# EAGLE design sensor dev board (EAGLE 6.4)
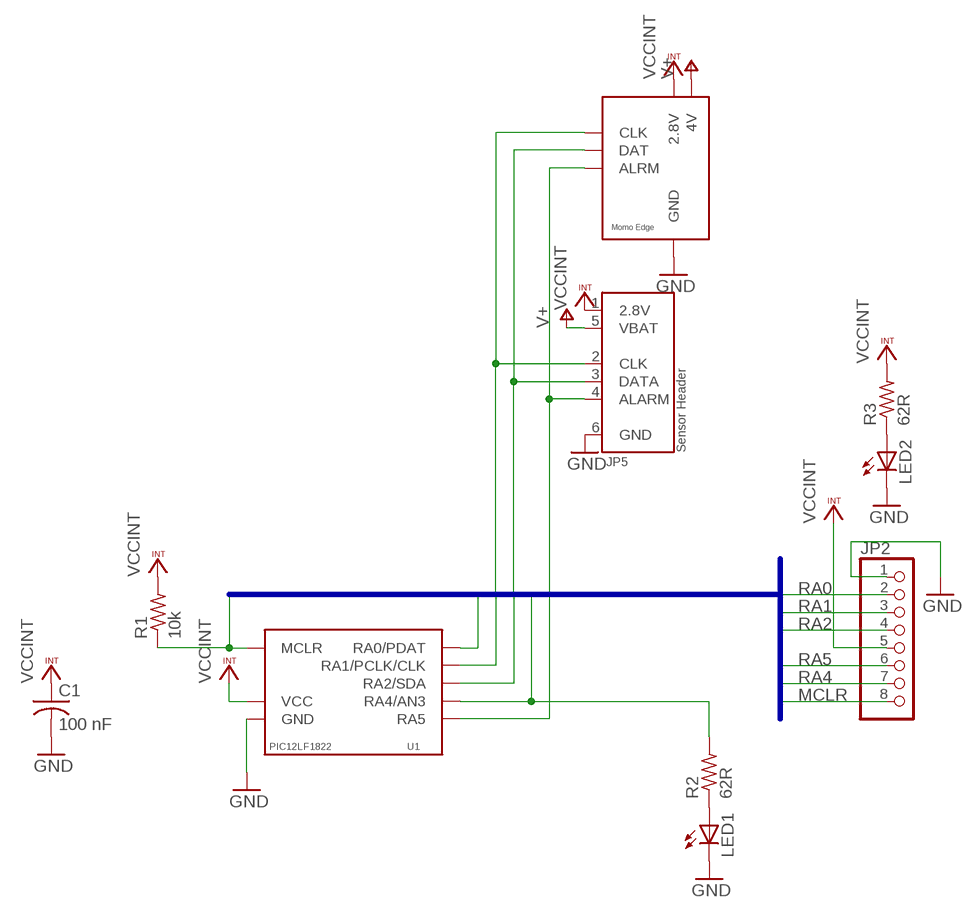
[diagram p0: schematic, sheet 1]

## Parts
C1  100 nF  C-USC0402  [C0402]
JP2  PINHD-1X8  [1X08]
JP4  MOMO-VERT-6M  [1X06]
JP5  MOMO-SENSOR-RJ11  [RJ-12]
LED1  LEDCHIP-LED0603  [CHIP-LED0603]
LED2  LEDCHIP-LED0603  [CHIP-LED0603]
R1  10k  R-US_R0603  [R0603]
R2  62R  R-US_R0603  [R0603]
R3  62R  R-US_R0603  [R0603]
U1  PIC12LF1822  [SOIC8]

## Nets
GND: C1.2 JP2.1 JP4.7(GND) JP5.6(GND) LED1.C LED2.C U1.8(GND)
MCLR: JP2.8 R1.1 U1.4(MCLR)
N$1: LED1.A R2.1
N$2: LED2.A R3.1
RA0: JP2.2 U1.7(RA0/PDAT)
RA1: JP2.3 JP4.3(CLK) JP5.2(CLK) U1.6(RA1/PCLK/CLK)
RA2: JP2.4 JP4.4(DAT) JP5.3(DATA) U1.5(RA2/SDA)
RA4: JP2.7 R2.2 U1.3(RA4/AN3)
RA5: JP2.6 JP4.5(ALRM) JP5.4(ALARM) U1.2(RA5)
V+: JP4.6(4V) JP5.5(VBAT)
VCCINT: C1.1 JP2.5 JP4.1(2.8V) JP5.1(2.8V) R1.2 R3.2 U1.1(VCC)

## Buses
BUS:MCLR,POWER28,RA0,RA1,RA2,RA4,RA5

## Library data of the parts
C1 = rcl:C-US: CAPACITOR, American symbol; DIGIKEY-PN: 445-1265-1-ND
JP2 = pinhead:PINHD-1X8: PIN HEADER; DIGIKEY-PN: S1012EC-08-ND
JP4 = components:MOMO-VERT-6M; DIGIKEY-PN: S7004-ND
JP5 = components:MOMO-SENSOR-RJ11; DIGIKEY-PN: AE10383-ND
LED1 LED2 = led:LED: LED OSRAM: - CHIPLED LG R971, LG N971, LY N971, LG Q971, LY Q971, LO R971, LY R971 LH N974, LH R974 LS Q976, LO Q976, LY Q976 LO Q996 - Hyper CHIPLED LW Q18S LB Q993, LB Q99A, LB R99A - SideLED LS A670, LO A670, LY A670, LG A670, LP A670 LB A673, LV A673, LT A673, LW A673 LH A674 LY A675 LS A676, LA A676, LO A676, LY A676, LW A676 LS A679, LY A679, LG A679 - Hyper Micro SIDELED® LS Y876, LA Y876, LO Y876, LY Y876 LT Y87S - SmartLED LW L88C, LW L88S LB L89C, LB L89S, LG L890 LS L89K, LO L89K, LY L89K LS L896, LA L896, LO L896, LY L896 - TOPLED LS T670, LO T670, LY T670, LG T670, LP T670 LSG T670, LSP T670, LSY T670, LOP T670, LYG T670 LG T671, LOG T671, LSG T671 LB T673, LV T673, LT T673, LW T673 LH T674 LS T676, LA T676, LO T676, LY T676, LB T676, LH T676, LSB T676, LW T676 LB T67C, LV T67C, LT T67C, LS T67K, LO T67K, LY T67K, LW E67C LS E67B, LA E67B, LO E67B, LY E67B, LB E67C, LV E67C, LT E67C LW T67C LS T679, LY T679, LG T679 LS T770, LO T770, LY T770, LG T770, LP T770 LB T773, LV T773, LT T773, LW T773 LH T774 LS E675, LA E675, LY E675, LS T675 LS T776, LA T776, LO T776, LY T776, LB T776 LHGB T686 LT T68C, LB T68C - Hyper Mini TOPLED® LB M676 - Mini TOPLED Santana® LG M470 LS M47K, LO M47K, LY M47K Source: http://www.osram.convergy.de LUXEON: - LUMILED® LXK2-PW12-R00, LXK2-PW12-S00, LXK2-PW14-U00, LXK2-PW14-V00 LXK2-PM12-R00, LXK2-PM12-S00, LXK2-PM14-U00 LXK2-PE12-Q00, LXK2-PE12-R00, LXK2-PE12-S00, LXK2-PE14-T00, LXK2-PE14-U00 LXK2-PB12-K00, LXK2-PB12-L00, LXK2-PB12-M00, LXK2-PB14-N00, LXK2-PB14-P00, LXK2-PB14-Q00 LXK2-PR12-L00, LXK2-PR12-M00, LXK2-PR14-Q00, LXK2-PR14-R00 LXK2-PD12-Q00, LXK2-PD12-R00, LXK2-PD12-S00 LXK2-PH12-R00, LXK2-PH12-S00 LXK2-PL12-P00, LXK2-PL12-Q00, LXK2-PL12-R00 Source: www.luxeon.com KINGBRIGHT: KA-3528ASYC Source: www.kingbright.com; DIGIKEY-PN: 475-2709-1-ND
R1 = rcl:R-US_: RESISTOR, American symbol; DIGIKEY-PN: P10.0KHCT-ND
R2 R3 = resistor:R-US_: RESISTOR, American symbol; DIGIKEY-PN: P62GCT-ND
U1 = components:PIC12LF1822; DIGIKEY-PN: PIC12LF1822-I/SN

## Board
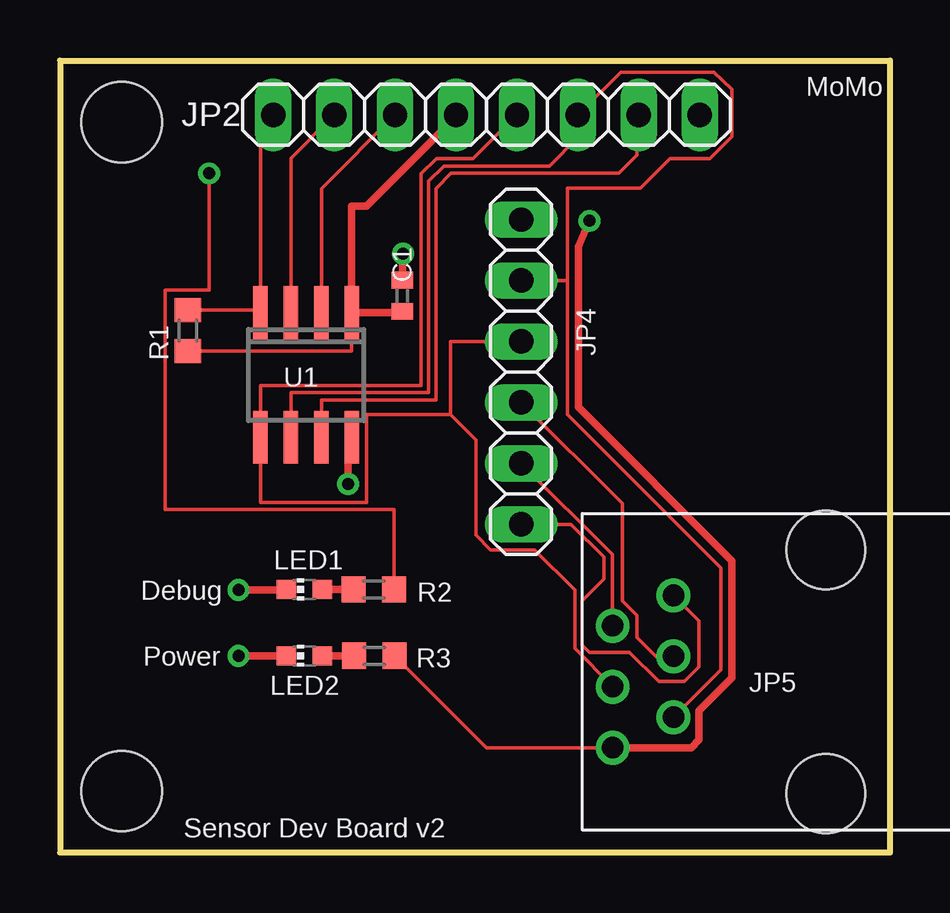
[diagram p1: board, top side]
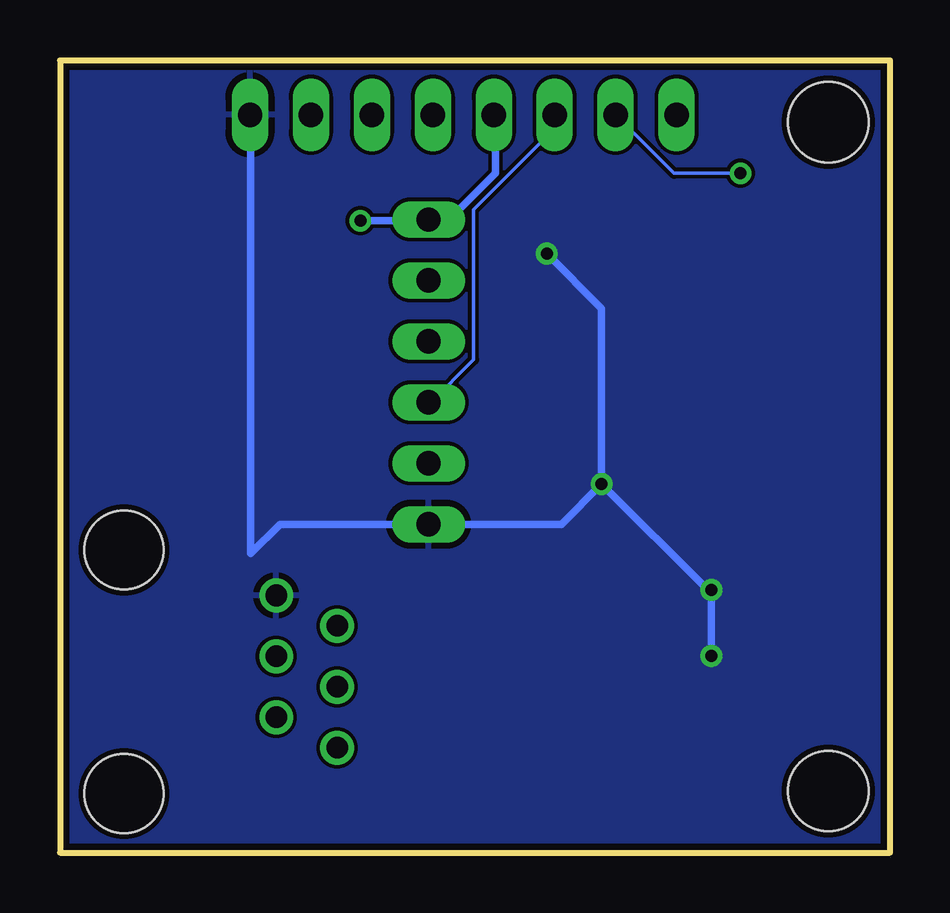
[diagram p2: board, bottom side, seen from below]

Size 34.59 x 33.02 mm. Coordinates in mm from the lower left corner, seen from the top.
Outline: 0,33.02 0,0 34.6,0 34.6,33.02 0,33.02
Copper layers (1*16): Top 0.035mm / dielectric 1.5mm / Bottom 0.035mm
Design rules "default": minimum track width 6mil, minimum drill 19mil, track to track 6mil, track to pad 6mil, pad to pad 6mil, via to via 6mil, smd to smd 6mil, copper to edge 10mil, drill to drill 8mil, minimum pad ring 10mil, minimum via ring 8mil, stop-mask expansion 4mil, vias tented up to drill 0mil, thermal gap 10mil
Holes 3.35 mm at 2.57,30.45 2.57,2.57

### Footprints (pad centres in the part's own frame; a part is rotated, then mirrored left to right if it is on the bottom)
C0402 = smd 0.7 x 0.9: 1 -0.65,0; 2 0.65,0
1X08 = drill 1.016 long: 1 -8.89,0; 2 -6.35,0; 3 -3.81,0; 4 -1.27,0; 5 1.27,0; 6 3.81,0; 7 6.35,0; 8 8.89,0
1X06 = drill 1.016 long: 1 -8.89,0; 3 -6.35,0; 4 -3.81,0; 5 -1.27,0; 6 1.27,0; 7 3.81,0
RJ-12 = drill 0.9: 1 -3.17,8.89; 2 -1.9,6.35; 3 -0.63,8.89; 4 0.64,6.35; 5 1.91,8.89; 6 3.18,6.35 | hole 3.28: -5.08,0; 5.08,0
CHIP-LED0603 = smd 0.8 x 0.8: A 0,-0.75; C 0,0.75
R0603 = smd 1 x 1.1: 1 -0.85,0; 2 0.85,0
SOIC8 = smd 0.6 x 2.2: 1 -1.905,-2.6; 2 -0.635,-2.6; 3 0.635,-2.6; 4 1.905,-2.6; 5 1.905,2.6; 6 0.635,2.6; 7 -0.635,2.6; 8 -1.905,2.6

### Placement (x,y rotation side)
C1  14.27,23.22 90 top
JP2  17.78,30.76 180 top
JP4  19.23,17.5 270 top
JP5  31.93,7.54 90 top
LED1  10.19,10.97 90 top
LED2  10.19,8.2 90 top
R1  5.33,21.77 270 top
R2  13.08,10.97 0 top
R3  13.11,8.2 0 top
U1  10.26,19.91 180 top

### Tracks (layer width: path | path; a pad name or v marks a point on that pad's centre or on a via)
GND  (via drill 0.5)
  Top 0.152: JP5.6 26.64,9.66 26.64,7.75 26.04,7.14 24.97,7.14 23.75,8.36 22.07,8.36 21.77,8.66 21.77,10.49 22.68,11.4 22.68,12.32 21.31,13.69 JP4.7
  Top 0.305: v12.01,15.37 12.01,17.31 U1.8 | C1.2 14.28,24.97 v14.3,24.97 | 7.54,8.1 v7.44,8.2 LED2.C | v7.44,10.95 9.44,10.95 LED1.C
  Bottom 0.305: v12.01,15.37 13.69,13.69 JP4.7 25.43,13.69 26.64,12.47 26.64,30.73 JP2.1 | v14.3,24.97 12.01,22.68 v12.01,15.37 | v7.44,8.2 v7.44,10.95 7.59,10.95 v12.01,15.37
  pour Bottom: 0.2,32.82 0.2,0.18 34.39,0.18 34.39,32.82
MCLR
  Top 0.152: JP2.8 8.36,30.23 U1.4 8.25,22.62 R1.1
N$1
  Top 0.305: LED1.A R2.1
N$2
  Top 0.305: LED2.A R3.1
RA0
  Top 0.152: U1.7 10.9,18.87 15.67,18.87 15.67,27.69 16.31,28.32 23.29,28.32 24.05,29.08 24.05,30.68 JP2.2
RA1
  Top 0.152: U1.6 9.63,19.18 15.37,19.18 15.37,27.99 16,28.63 20.4,28.63 21.59,29.82 JP2.3 23.39,32.54 27.25,32.54 28.02,31.83 28.02,29.85 27.1,28.93 25.43,28.93 24.21,27.71 21.16,27.71 21.16,23.85 | JP4.3 21.16,23.85 | JP5.2 27.56,7.63 27.56,11.86 21.16,18.26 21.16,23.85
RA2
  Top 0.152: JP2.4 17.22,28.93 15.7,28.93 15.06,28.3 15.06,19.48 8.36,19.48 U1.5 8.36,14.61 12.78,14.61 12.78,18.26 16.28,18.26 | JP4.4 16.28,21.31 16.28,18.26 | JP5.3 23.04,6.93 21.46,8.51 21.46,10.95 19.79,12.62 17.96,12.62 17.35,13.23 17.35,17.2 16.28,18.26
RA4  (via drill 0.5)
  Top 0.152: U1.3 9.63,28.96 JP2.7 | R2.2 13.93,14.3 4.39,14.3 4.39,23.44 6.22,23.44 v6.22,28.32
  Bottom 0.152: v6.22,28.32 8.99,28.32 JP2.7
RA5
  Top 0.152: U1.2 10.9,27.69 JP2.6 | JP4.5 23.44,14.55 23.44,10.49 24.05,9.88 24.05,8.97 24.84,8.18 JP5.4
  Bottom 0.152: JP4.5 19.13,18.77 17.35,20.55 17.35,26.8 13.97,30.18 JP2.6
V+
  Top 0.152: JP4.6 23.04,12.42 JP5.5
VCCINT  (via drill 0.5)
  Top 0.152: R3.2 17.79,4.37 JP5.1 | R1.2 12.17,20.92 U1.1
  Top 0.305: JP2.5 16.28,30.45 12.78,26.95 12.17,26.95 U1.1 14.28,22.51 C1.1 | v22.07,26.34 21.62,25.27 21.62,18.57 28.02,12.17 28.02,7.29 26.64,5.92 26.64,4.7 26.32,4.37 JP5.1
  Bottom 0.305: 18.42,26.34 16.43,28.32 16.43,30.68 JP2.5 | 18.42,26.34 v22.07,26.34 | 18.42,26.34 18.47,26.39 JP4.1

### Text on the board
tPlace: MoMo | Debug | Power | Sensor Dev Board v2
tStop: Debug